# Altium schematic sheet POWER.SchDoc: Title
size A3; Date: Date; CompanyName: Integrated Micro-Electronics Bulgaria; Organization: Design & Development Department; Address1: Drawing Type; Address2: Address 1; Address3: Address 2; Address4: Address 3; DocumentNumber: 730xxx; Revision: 01; SheetNumber: 1; SheetTotal: 1; PageSetup: Record=PageOptions|CenterHorizontal=True|CenterVertical=True|PrintScale=0.70|XCorrection=1.00|YCorrection=1.00|PrintKind=2|BorderSize=5000000|LeftOffset=0|BottomOffset=0|Orientation=2|PaperLength=1000|PaperWidth=1000|Scale=100|PaperSource=7|PrintQuality=-4|MediaType=1|DitherType=10|PaperKind=A4|PrintScaleMode=1; SheetSize: A3; Time: Time; ModifiedDate: Mod. Date
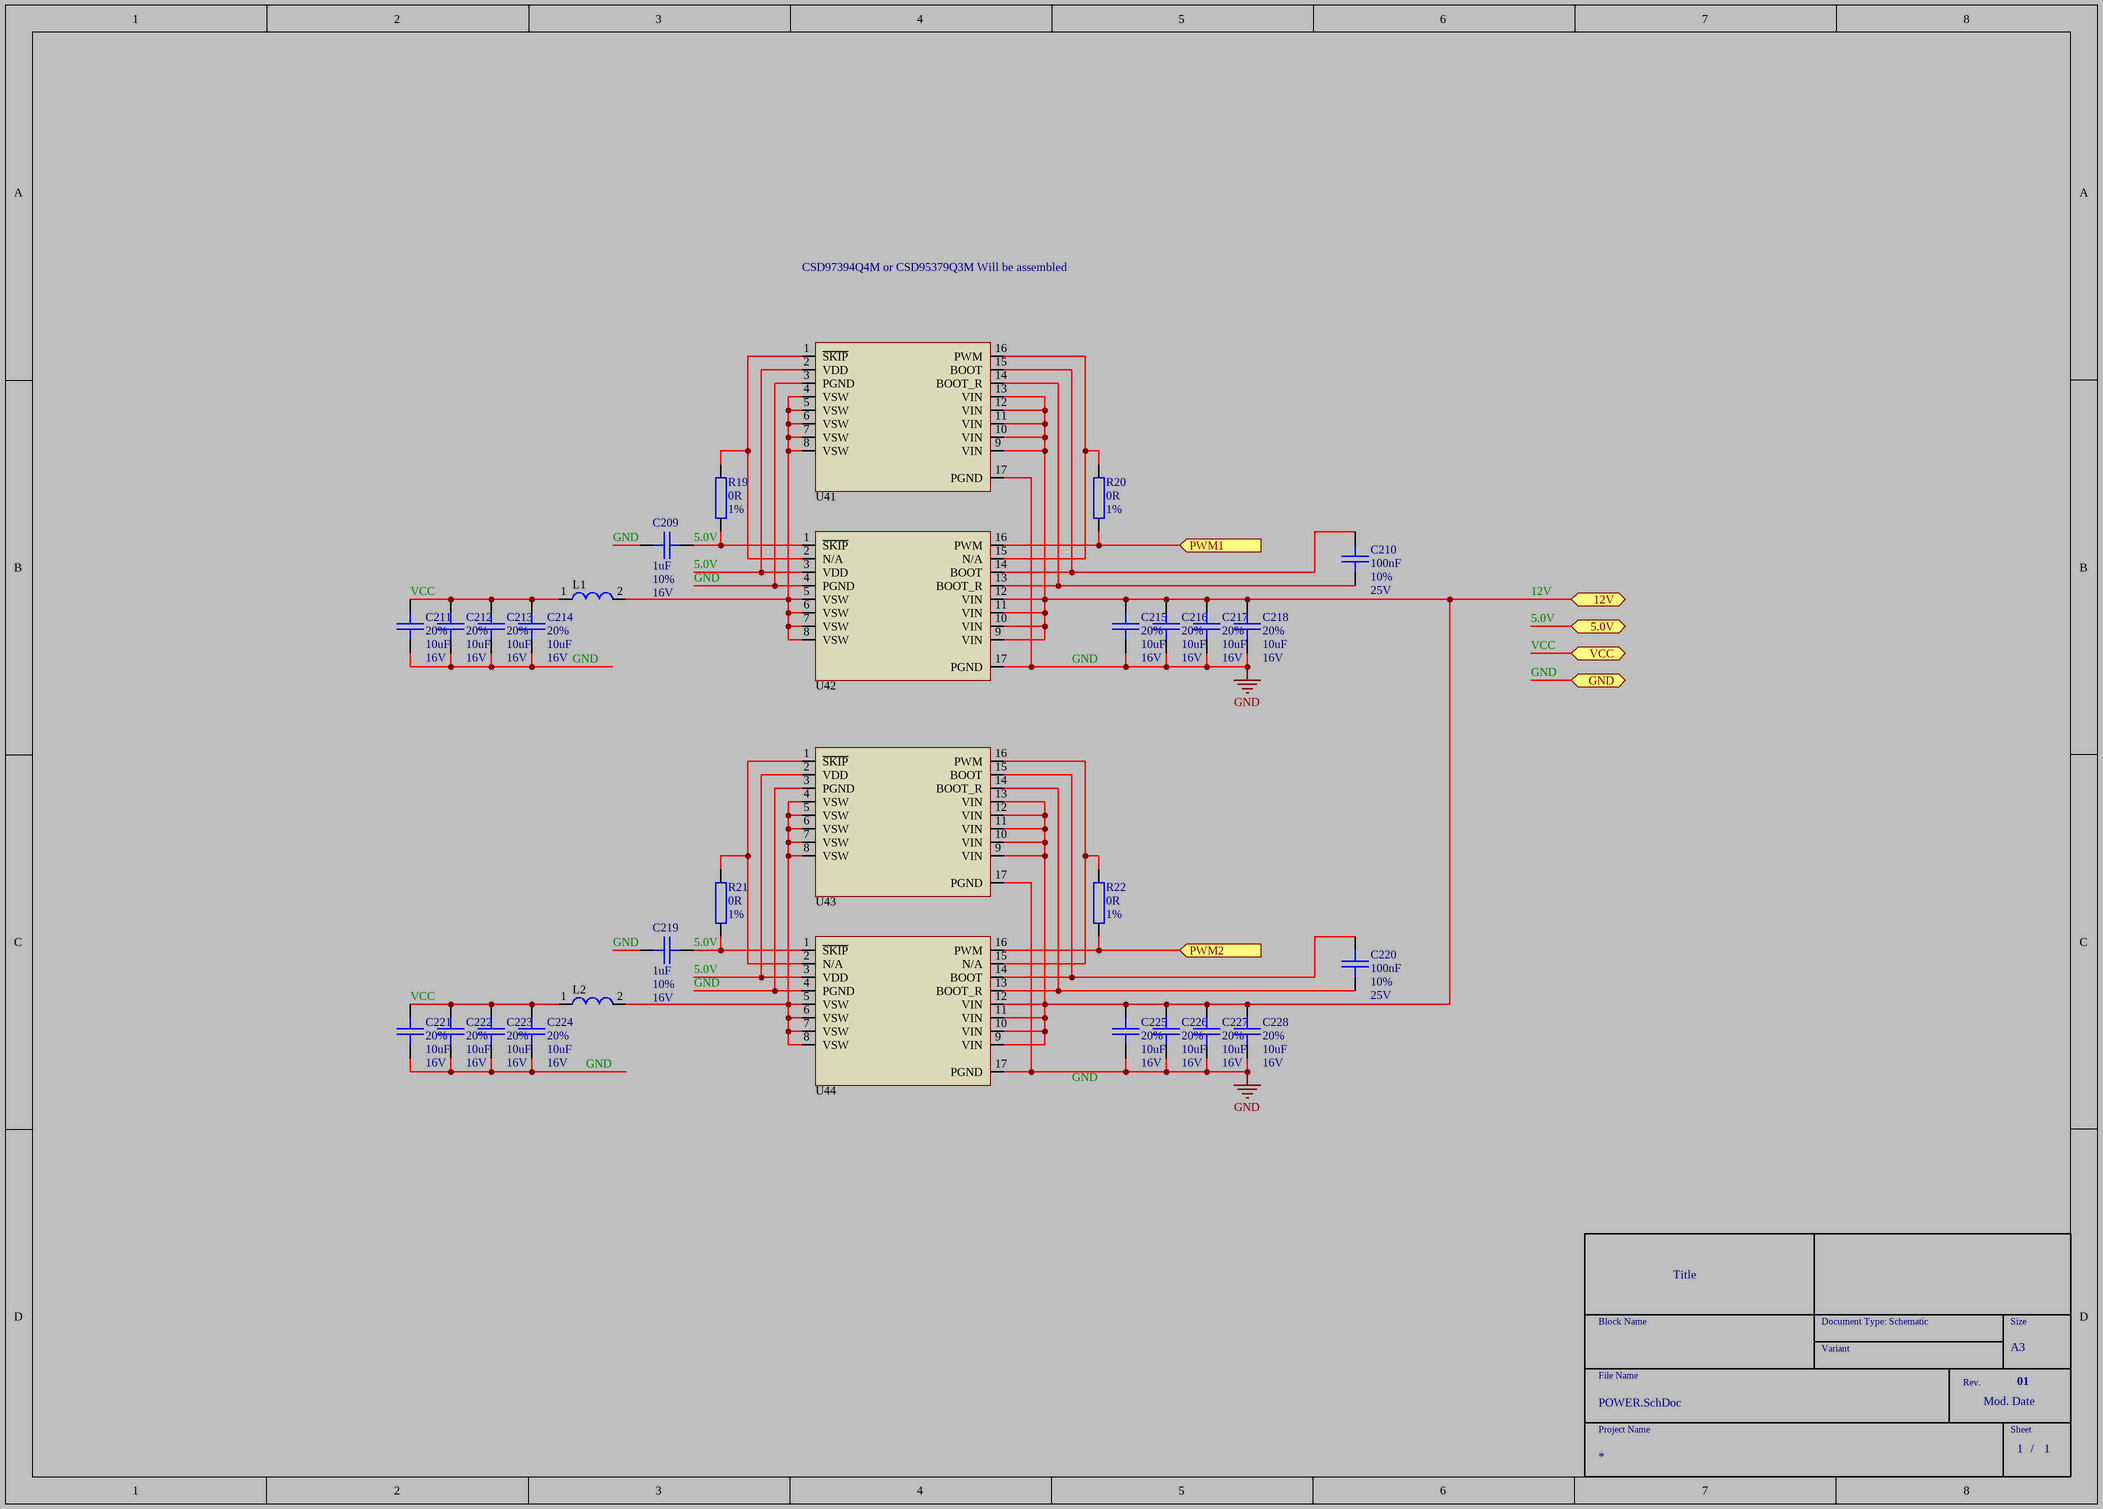
[diagram p0: POWER.SchDoc]

## Parts
C209  DB_VALUE: 1uF  DB_TOLERANCE: 10%  DB_VOLTAGE: 16V  [SMD_0603_CAPC1608X95N]  (hidden comment: C)
C210  DB_VALUE: 100nF  DB_TOLERANCE: 10%  DB_VOLTAGE: 25V  [SMD_0402_CAPC1005X55N]  (hidden comment: C)
C211  DB_TOLERANCE: 20%  DB_VALUE: 10uF  DB_VOLTAGE: 16V  [SMD_0805_CAPC2012X145N]  (hidden comment: C)
C212  DB_TOLERANCE: 20%  DB_VALUE: 10uF  DB_VOLTAGE: 16V  [SMD_0805_CAPC2012X145N]  (hidden comment: C)
C213  DB_TOLERANCE: 20%  DB_VALUE: 10uF  DB_VOLTAGE: 16V  [SMD_0805_CAPC2012X145N]  (hidden comment: C)
C214  DB_TOLERANCE: 20%  DB_VALUE: 10uF  DB_VOLTAGE: 16V  [SMD_0805_CAPC2012X145N]  (hidden comment: C)
C215  DB_TOLERANCE: 20%  DB_VALUE: 10uF  DB_VOLTAGE: 16V  [SMD_0805_CAPC2012X145N]  (hidden comment: C)
C216  DB_TOLERANCE: 20%  DB_VALUE: 10uF  DB_VOLTAGE: 16V  [SMD_0805_CAPC2012X145N]  (hidden comment: C)
C217  DB_TOLERANCE: 20%  DB_VALUE: 10uF  DB_VOLTAGE: 16V  [SMD_0805_CAPC2012X145N]  (hidden comment: C)
C218  DB_TOLERANCE: 20%  DB_VALUE: 10uF  DB_VOLTAGE: 16V  [SMD_0805_CAPC2012X145N]  (hidden comment: C)
C219  DB_VALUE: 1uF  DB_TOLERANCE: 10%  DB_VOLTAGE: 16V  [SMD_0603_CAPC1608X95N]  (hidden comment: C)
C220  DB_VALUE: 100nF  DB_TOLERANCE: 10%  DB_VOLTAGE: 25V  [SMD_0402_CAPC1005X55N]  (hidden comment: C)
C221  DB_TOLERANCE: 20%  DB_VALUE: 10uF  DB_VOLTAGE: 16V  [SMD_0805_CAPC2012X145N]  (hidden comment: C)
C222  DB_TOLERANCE: 20%  DB_VALUE: 10uF  DB_VOLTAGE: 16V  [SMD_0805_CAPC2012X145N]  (hidden comment: C)
C223  DB_TOLERANCE: 20%  DB_VALUE: 10uF  DB_VOLTAGE: 16V  [SMD_0805_CAPC2012X145N]  (hidden comment: C)
C224  DB_TOLERANCE: 20%  DB_VALUE: 10uF  DB_VOLTAGE: 16V  [SMD_0805_CAPC2012X145N]  (hidden comment: C)
C225  DB_TOLERANCE: 20%  DB_VALUE: 10uF  DB_VOLTAGE: 16V  [SMD_0805_CAPC2012X145N]  (hidden comment: C)
C226  DB_TOLERANCE: 20%  DB_VALUE: 10uF  DB_VOLTAGE: 16V  [SMD_0805_CAPC2012X145N]  (hidden comment: C)
C227  DB_TOLERANCE: 20%  DB_VALUE: 10uF  DB_VOLTAGE: 16V  [SMD_0805_CAPC2012X145N]  (hidden comment: C)
C228  DB_TOLERANCE: 20%  DB_VALUE: 10uF  DB_VOLTAGE: 16V  [SMD_0805_CAPC2012X145N]  (hidden comment: C)
L1  470nH  [SMT_INDM135130X800N]  (value not drawn)
L2  470nH  [SMT_INDM135130X800N]  (value not drawn)
R19  DB_VALUE: 0R  DB_TOLERANCE: 1%  [SMD_0603_RESC1608X55N]  (hidden comment: R)
R20  DB_VALUE: 0R  DB_TOLERANCE: 1%  [SMD_0603_RESC1608X55N]  (hidden comment: R)
R21  DB_VALUE: 0R  DB_TOLERANCE: 1%  [SMD_0603_RESC1608X55N]  (hidden comment: R)
R22  DB_VALUE: 0R  DB_TOLERANCE: 1%  [SMD_0603_RESC1608X55N]  (hidden comment: R)
U41  CSD95379Q3M  [SMD_SON40P330X330X100-17N]  (value not drawn)
U42  CSD95379Q3M  [SMD_SON40P330X330X100-17N]  (value not drawn)
U43  CSD95379Q3M  [SMD_SON40P330X330X100-17N]  (value not drawn)
U44  CSD95379Q3M  [SMD_SON40P330X330X100-17N]  (value not drawn)

## Ports
5.0V, 12V, GND, PWM1 (in), PWM2 (in), VCC

## Nets
GND: C209.2 C211.2 C212.2 C213.2 C214.2 C215.2 C216.2 C217.2 C218.2 C219.2 C221.2 C222.2 C223.2 C224.2 C225.2 C226.2 C227.2 C228.2 U41.3(PGND) U41.17(PGND) U42.4(PGND) U42.17(PGND) U43.3(PGND) U43.17(PGND) U44.4(PGND) U44.17(PGND) ; port GND
5.0V: C209.1 C219.1 R19.1 R21.1 U41.2(VDD) U42.1(~{SKIP}) U42.3(VDD) U43.2(VDD) U44.1(~{SKIP}) U44.3(VDD) ; port 5.0V
12V: C215.1 C216.1 C217.1 C218.1 C225.1 C226.1 C227.1 C228.1 U41.9(VIN) U41.10(VIN) U41.11(VIN) U41.12(VIN) U41.13(VIN) U42.9(VIN) U42.10(VIN) U42.11(VIN) U42.12(VIN) U43.9(VIN) U43.10(VIN) U43.11(VIN) U43.12(VIN) U43.13(VIN) U44.9(VIN) U44.10(VIN) U44.11(VIN) U44.12(VIN) ; port 12V
PWM1: R20.1 U42.16(PWM) ; port PWM1
PWM2: R22.1 U44.16(PWM) ; port PWM2
VCC: C211.1 C212.1 C213.1 C214.1 C221.1 C222.1 C223.1 C224.1 L1.1 L2.1 ; port VCC
NetC210_1: C210.1 U41.15(BOOT) U42.14(BOOT)
NetC210_2: C210.2 U41.14(BOOT_R) U42.13(BOOT_R)
NetC220_1: C220.1 U43.15(BOOT) U44.14(BOOT)
NetC220_2: C220.2 U43.14(BOOT_R) U44.13(BOOT_R)
NetL1_2: L1.2 U41.4(VSW) U41.5(VSW) U41.6(VSW) U41.7(VSW) U41.8(VSW) U42.5(VSW) U42.6(VSW) U42.7(VSW) U42.8(VSW)
NetL2_2: L2.2 U43.4(VSW) U43.5(VSW) U43.6(VSW) U43.7(VSW) U43.8(VSW) U44.5(VSW) U44.6(VSW) U44.7(VSW) U44.8(VSW)
NetR19_2: R19.2 U41.1(~{SKIP}) U42.2(N/A)
NetR20_2: R20.2 U41.16(PWM) U42.15(N/A)
NetR21_2: R21.2 U43.1(~{SKIP}) U44.2(N/A)
NetR22_2: R22.2 U43.16(PWM) U44.15(N/A)

## Notes on the sheet
- CSD97394Q4M or CSD95379Q3M Will be assembled
- Block Name
- Document Type: Schematic
- Size
- File Name
- Variant
- Rev.
- Project Name
- Sheet
- /
- Labels drawn without touching a wire or pin: GND

## Library data of the parts
C209 C219 = CAP000023307: DB_PART_TYPE: Ceramic_SMD\Open_Mode_X7R; DB_MANUFACTURER_PART: KEMET    C0603F105K4RAC; NOTE: <NOTE>; DB_T_RANGE: -55 to 125; DB_PACKAGE: 0603; DB_DESCRIPTION: C X7R 1uF 10% 16V 0603; DB_STATUS: NEW; DB_PART_NUMBER: CAP000023307; DB_PCB_DEVICE: SMD_0603_CAPC1608X95N; DB_APPROVED_ON: 09.10.2010; DB_DATASHEET: http://john.epiqdesign.com/projects/CIS_Datasheets/F3102_CE_Kemet.pdf?rev=92&sc=0
C210 C220 = CAP000047469: DB_PART_TYPE: Ceramic_SMD\Standard_X5R; DB_MANUFACTURER_PART: SAMSUNG    CL05A104KA5NNNC; NOTE: <NOTE>; DB_T_RANGE: -55 to 85; DB_PACKAGE: 0402; DB_DESCRIPTION: C X5R 100nF 10% 25V 0402; DB_APPROVED_BY: VSN; DB_STATUS: NEW; DB_PART_NUMBER: CAP000047469; DB_PCB_DEVICE: SMD_0402_CAPC1005X55N; DB_APPROVED_ON: 08.03.2016 08:26:43; DB_DATASHEET: http://john.epiqdesign.com/projects/CIS_Datasheets/CAP_CL05A104KA5NNNC_100nF_X5R_25V_10_0402_Samsung.pdf?rev=1997&sc=0
C211-C218 C221-C228 = CAP000043650: DB_MANUFACTURER_PART: KEMET    C0805C106M4PAC; DB_PART_TYPE: Ceramic_SMD\Standard_X5R; NOTE: <NOTE>; DB_DESCRIPTION: C X5R 10uF 20% 16V 0805; DB_PACKAGE: 0805; DB_STATUS: NEW; DB_T_RANGE: -55 to 85; DB_APPROVED_ON: 09.10.2010; DB_DATASHEET: http://john.epiqdesign.com/projects/CIS_Datasheets/F3102_CE_Kemet.pdf?rev=92&sc=0; DB_PART_NUMBER: CAP000043650; DB_PCB_DEVICE: SMD_0805_CAPC2012X145N
L1 L2 = L: DB_PCB_DEVICE: SMT_INDM135130X800N
R19-R22 = RES000008926: DB_PART_TYPE: SMD; DB_MANUFACTURER_PART: YAGEO    AC0603FR-070RL; NOTE: <NOTE>; DB_T_RANGE: -55 to 155; DB_POWER: 1/10W; DB_PACKAGE: 0603; DB_DESCRIPTION: R SMD 0R 1% 1/10W 0603; DB_CERTIFIED: AUT; DB_APPROVED_BY: VSN; DB_STATUS: NEW; R_BDS: R; DB_PART_NUMBER: RES000008926; DB_PCB_DEVICE: SMD_0603_RESC1608X55N; DB_APPROVED_ON: 21.05.2013 09:19:53; DB_DATASHEET: http://john.epiqdesign.com/projects/CIS_Datasheets/RES_AC_YAGEO.pdf?rev=263&sc=0
U41 U43 = IC_CSD97394Q4M: Texas Instrumendts Buck Boost DC-DC; DB_MANUFACTURER_PART: TEXAS INSTRUMENTS  CSD97394Q4M; DB_DESCRIPTION: IC CSD97394Q4M VSON-CLIP-10 EP; DB_PACKAGE: VSON-CLIP-10 EP; DB_PCB_DEVICE: SMD_SON40P330X330X100-17N; DB_VALUE: CSD97394Q4M
U42 U44 = IC_CSD95379Q3M: Texas Instrumendts Buck Boost DC-DC; DB_MANUFACTURER_PART: TEXAS INSTRUMENTS  CSD95379Q3M; DB_DESCRIPTION: IC CSD95379Q3M VSON-CLIP-10 EP; DB_PACKAGE: VSON-CLIP-10 EP; DB_PCB_DEVICE: SMD_SON40P330X330X100-17N; DB_VALUE: CSD95379Q3M